# EAGLE design lp_relay (EAGLE 6.6.0)
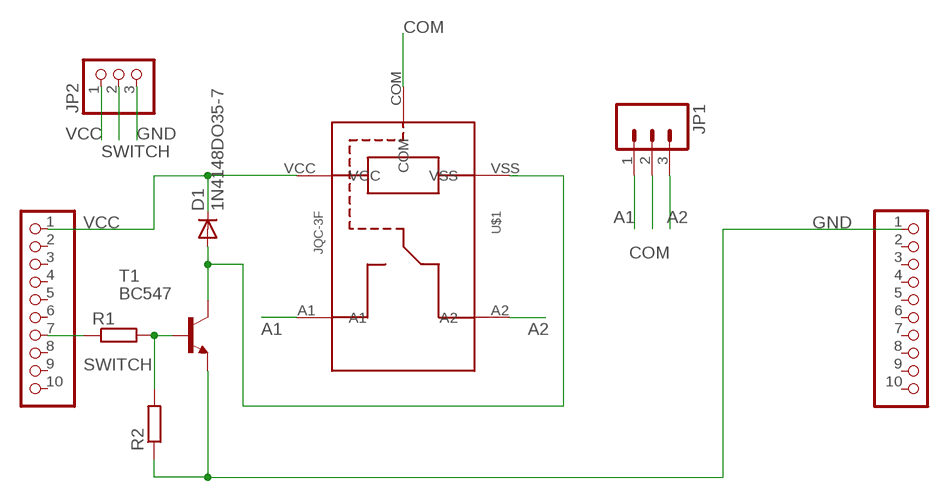
[diagram p0: schematic, sheet 1]

## Parts
D1  1N4148DO35-7  [DO35-7]
J1  J1  PINHD-1X10  [1X10]
J2  J2  PINHD-1X10  [1X10]
JP1  M03-SCREW-5MM  [SCREWTERMINAL-5MM-3]
JP2  PINHD-1X3  [1X03]
R1  R-EU_0207/10  [0207/10]
R2  R-EU_0207/10  [0207/10]
T1  BC547  [TO92]
U$1  JQC-3F  [JQC-3F]

## Nets
A1: JP1.1 U$1.A1
A2: JP1.3 U$1.A2
COM: JP1.2 U$1.COM
GND: J2.1 JP2.3 R2.1 T1.1(E)
N$2: R1.2 R2.2 T1.2(B)
N$4: D1.A T1.3(C) U$1.VSS
SWITCH: J1.7 JP2.2 R1.1
VCC: D1.C J1.1 JP2.1 U$1.VCC
Unconnected: J1.2 J1.3 J1.4 J1.5 J1.6 J1.8 J1.9 J1.10 J2.2 J2.3 J2.4 J2.5 J2.6 J2.7 J2.8 J2.9 J2.10

## Library data of the parts
D1 = diode:1N4148: DIODE high speed (Philips)
J1 J2 = pinhead:PINHD-1X10: PIN HEADER
JP1 = SparkFun-Connectors:M03: Header 3 Standard 3-pin 0.1" header. Use with straight break away headers (SKU : PRT-00116), right angle break away headers (PRT-00553), swiss pins (PRT-00743), machine pins (PRT-00117), and female headers (PRT-00115). Molex polarized connector foot print use with SKU : PRT-08232 with associated crimp pins and housings.
JP2 = pinhead:PINHD-1X3: PIN HEADER
R1 R2 = resistor:R-EU_: RESISTOR, European symbol
T1 = transistor:BC547: NPN TRANSISTOR
U$1 = thierry_eagle:JQC-3F: Miniature JQC-3F(T73) PCB relay

## Net classes
0 default: width 0.406 mm, drill 0.508 mm
1 GND: width 0.813 mm, drill 0.508 mm
2 VCC: width 1.016 mm, drill 0.508 mm

## Board
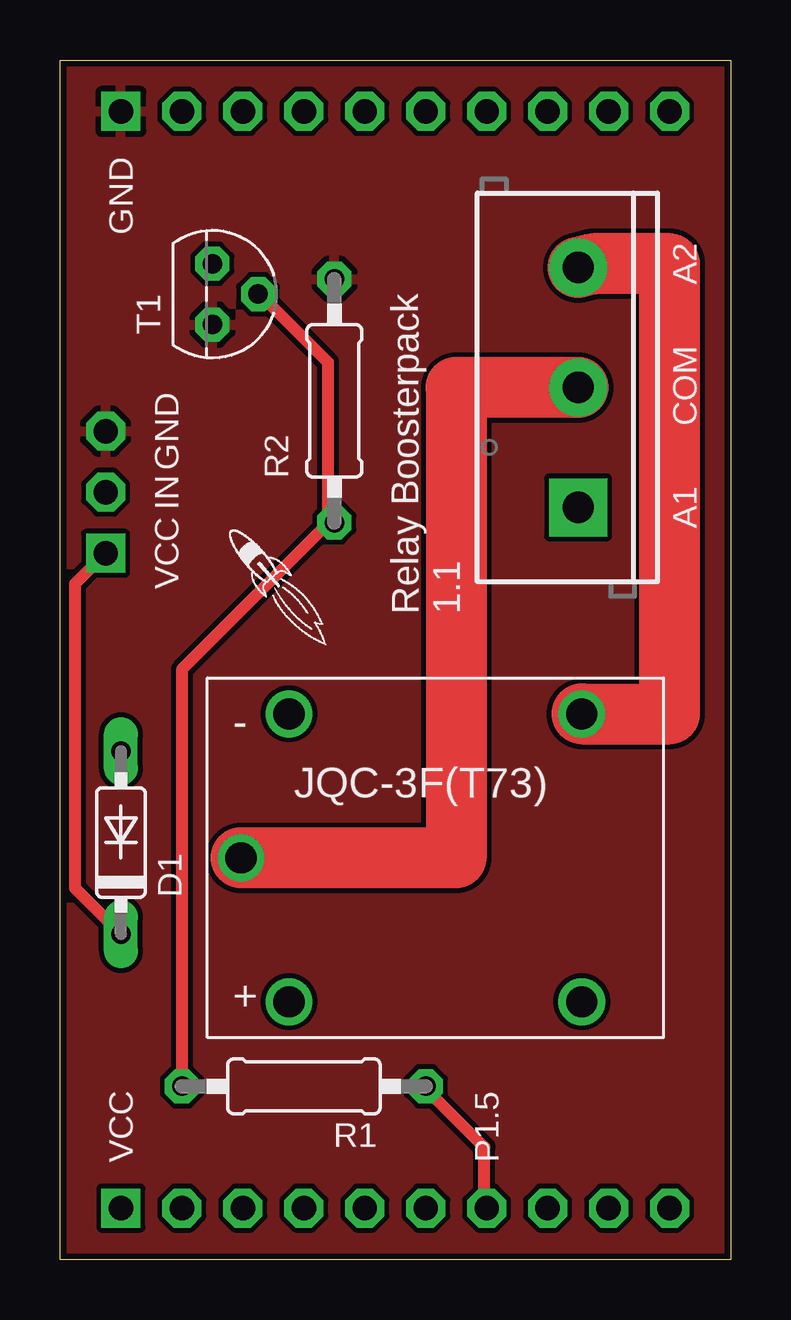
[diagram p1: board, top side]
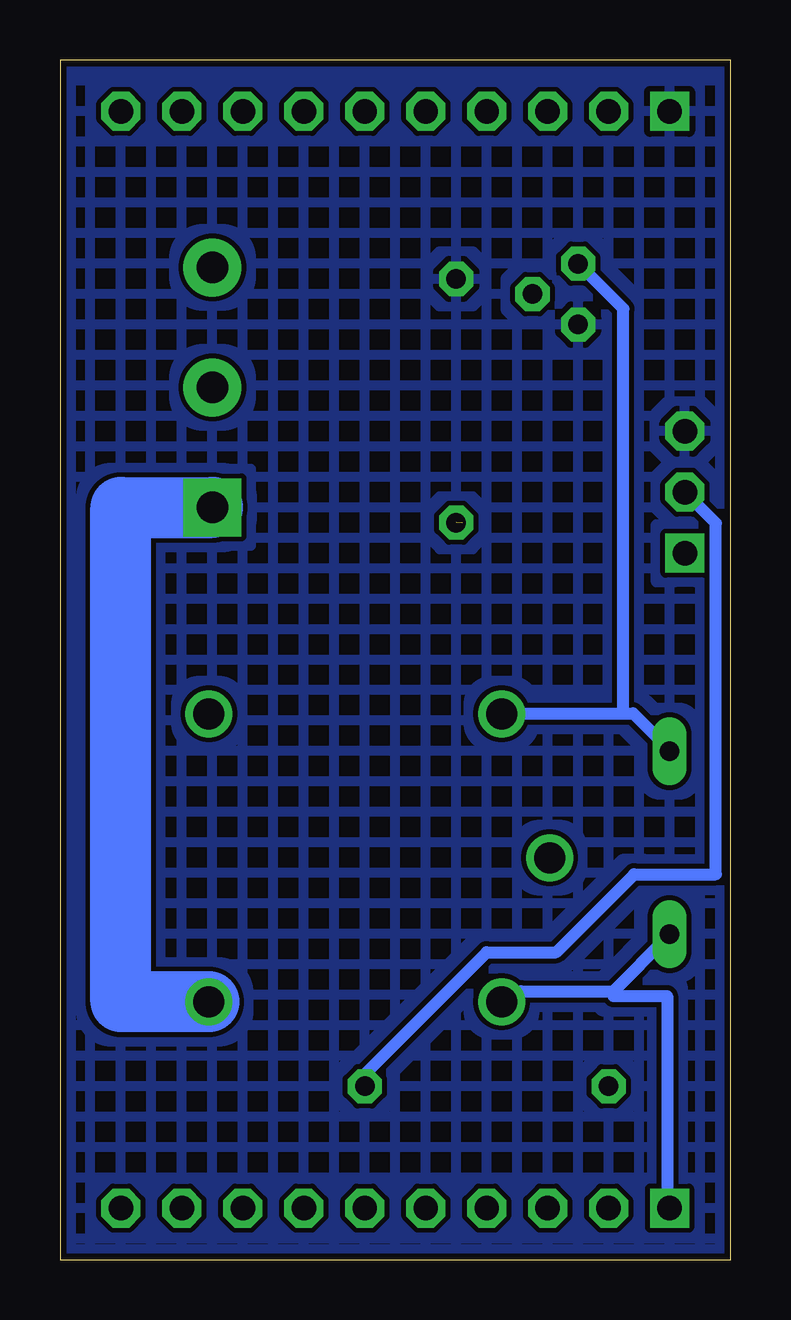
[diagram p2: board, bottom side, seen from below]

Size 27.94 x 50 mm. Coordinates in mm from the lower left corner, seen from the top.
Outline: 0,50 27.94,50 27.94,0 0,0 0,50
Copper layers (1*16): Top 0.035mm / dielectric 1.5mm / Bottom 0.035mm
Design rules "SparkFun *": minimum track width 20mil, minimum drill 20mil, track to track 8mil, track to pad 8mil, pad to pad 8mil, via to via 8mil, smd to smd 8mil, copper to edge 10mil, drill to drill 8mil, minimum pad ring 12mil, minimum via ring 10mil, stop-mask expansion 4mil, vias tented up to drill 25mil, thermal gap 10mil

### Footprints (pad centres in the part's own frame; a part is rotated, then mirrored left to right if it is on the bottom)
DO35-7 = drill 0.813 long: A 3.81,0; C -3.81,0
1X10 = drill 1.016 square: 1 -11.43,0 | drill 1.016 octagon: 2 -8.89,0; 3 -6.35,0; 4 -3.81,0; 5 -1.27,0; 6 1.27,0; 7 3.81,0; 8 6.35,0; 9 8.89,0; 10 11.43,0
SCREWTERMINAL-5MM-3 = drill 1.3 pad 2.413 square: 1 0,0 | drill 1.3 pad 2.413: 2 5,0; 3 10,0
1X03 = drill 1.016 square: 1 -2.54,0 | drill 1.016 octagon: 2 0,0; 3 2.54,0
0207/10 = drill 0.813 octagon: 1 -5.08,0; 2 5.08,0
TO92 = drill 0.813 octagon: 1 1.27,0; 2 0,1.905; 3 -1.27,0
JQC-3F = drill 1.3: A1 6.5,-6; A2 6.5,6; COM -7.7,0; VCC -5.7,-6; VSS -5.7,6

### Placement (x,y rotation side)
D1  2.54,17.38 90 top
J1  13.97,2.14 0 top
J2  13.97,47.86 0 top
JP1  21.59,31.35 90 top
JP2  1.91,31.98 90 top
R1  10.16,7.22 180 top
R2  11.43,35.8 270 top
T1  6.35,40.24 270 top
U$1  15.24,16.75 0 top
U$2  [LOGO-ROCKET]  8.89,28.18 90 top

### Tracks (layer width: path | path; a pad name or v marks a point on that pad's centre or on a via)
A1
  Bottom 2.54: U$1.A1 25.4,10.74 25.4,31.35 JP1.1
A2
  Top 2.54: U$1.A2 25.4,22.75 25.4,41.51 22.23,41.51 JP1.3
COM
  Top 2.54: JP1.2 16.51,36.35 16.51,16.75 U$1.COM
GND
  pour Bottom (hatched): 29.17,51.47 29.17,-1.67 -1.37,-1.77 -1.37,51.67 2.54,51.67
  pour Top: -1.37,51.47 29.21,51.47 29.21,-1.67 -1.37,-1.77
N$2  (1 unrouted)
  Top 0.508: T1.2 8.33,40.24 11.18,37.4 11.18,30.69 5.08,24.59 R1.2
N$4
  Bottom 0.508: 4.47,22.77 9.35,22.77 U$1.VSS | 4.47,22.77 4.06,22.77 2.64,21.34 D1.A | T1.3 4.47,39.63 4.47,22.77
SWITCH
  Top 0.508: R1.1 15.24,7.12 17.68,4.68 17.68,2.24 J1.7
  Bottom 0.508: JP2.2 0.61,30.69 0.61,16.06 4.01,16.06 7.26,12.81 10.16,12.81 15.24,7.73 R1.1
VCC
  Top 0.508: D1.C 0.64,15.47 0.64,28.18 JP2.1
  Bottom 0.508: 4.88,11.18 2.64,13.42 D1.C | 4.88,11.18 8.74,11.18 9.14,10.78 9.35,10.78 U$1.VCC | J1.1 2.64,2.24 2.64,10.98 4.88,10.98 4.88,11.18

### Text on the board
tNames: GND | A2 | COM | GND | IN | A1 | VCC | Relay Boosterpack / 1.1 | VCC | P1.5